# Altium project Power_Supply_5V.PrjPcb
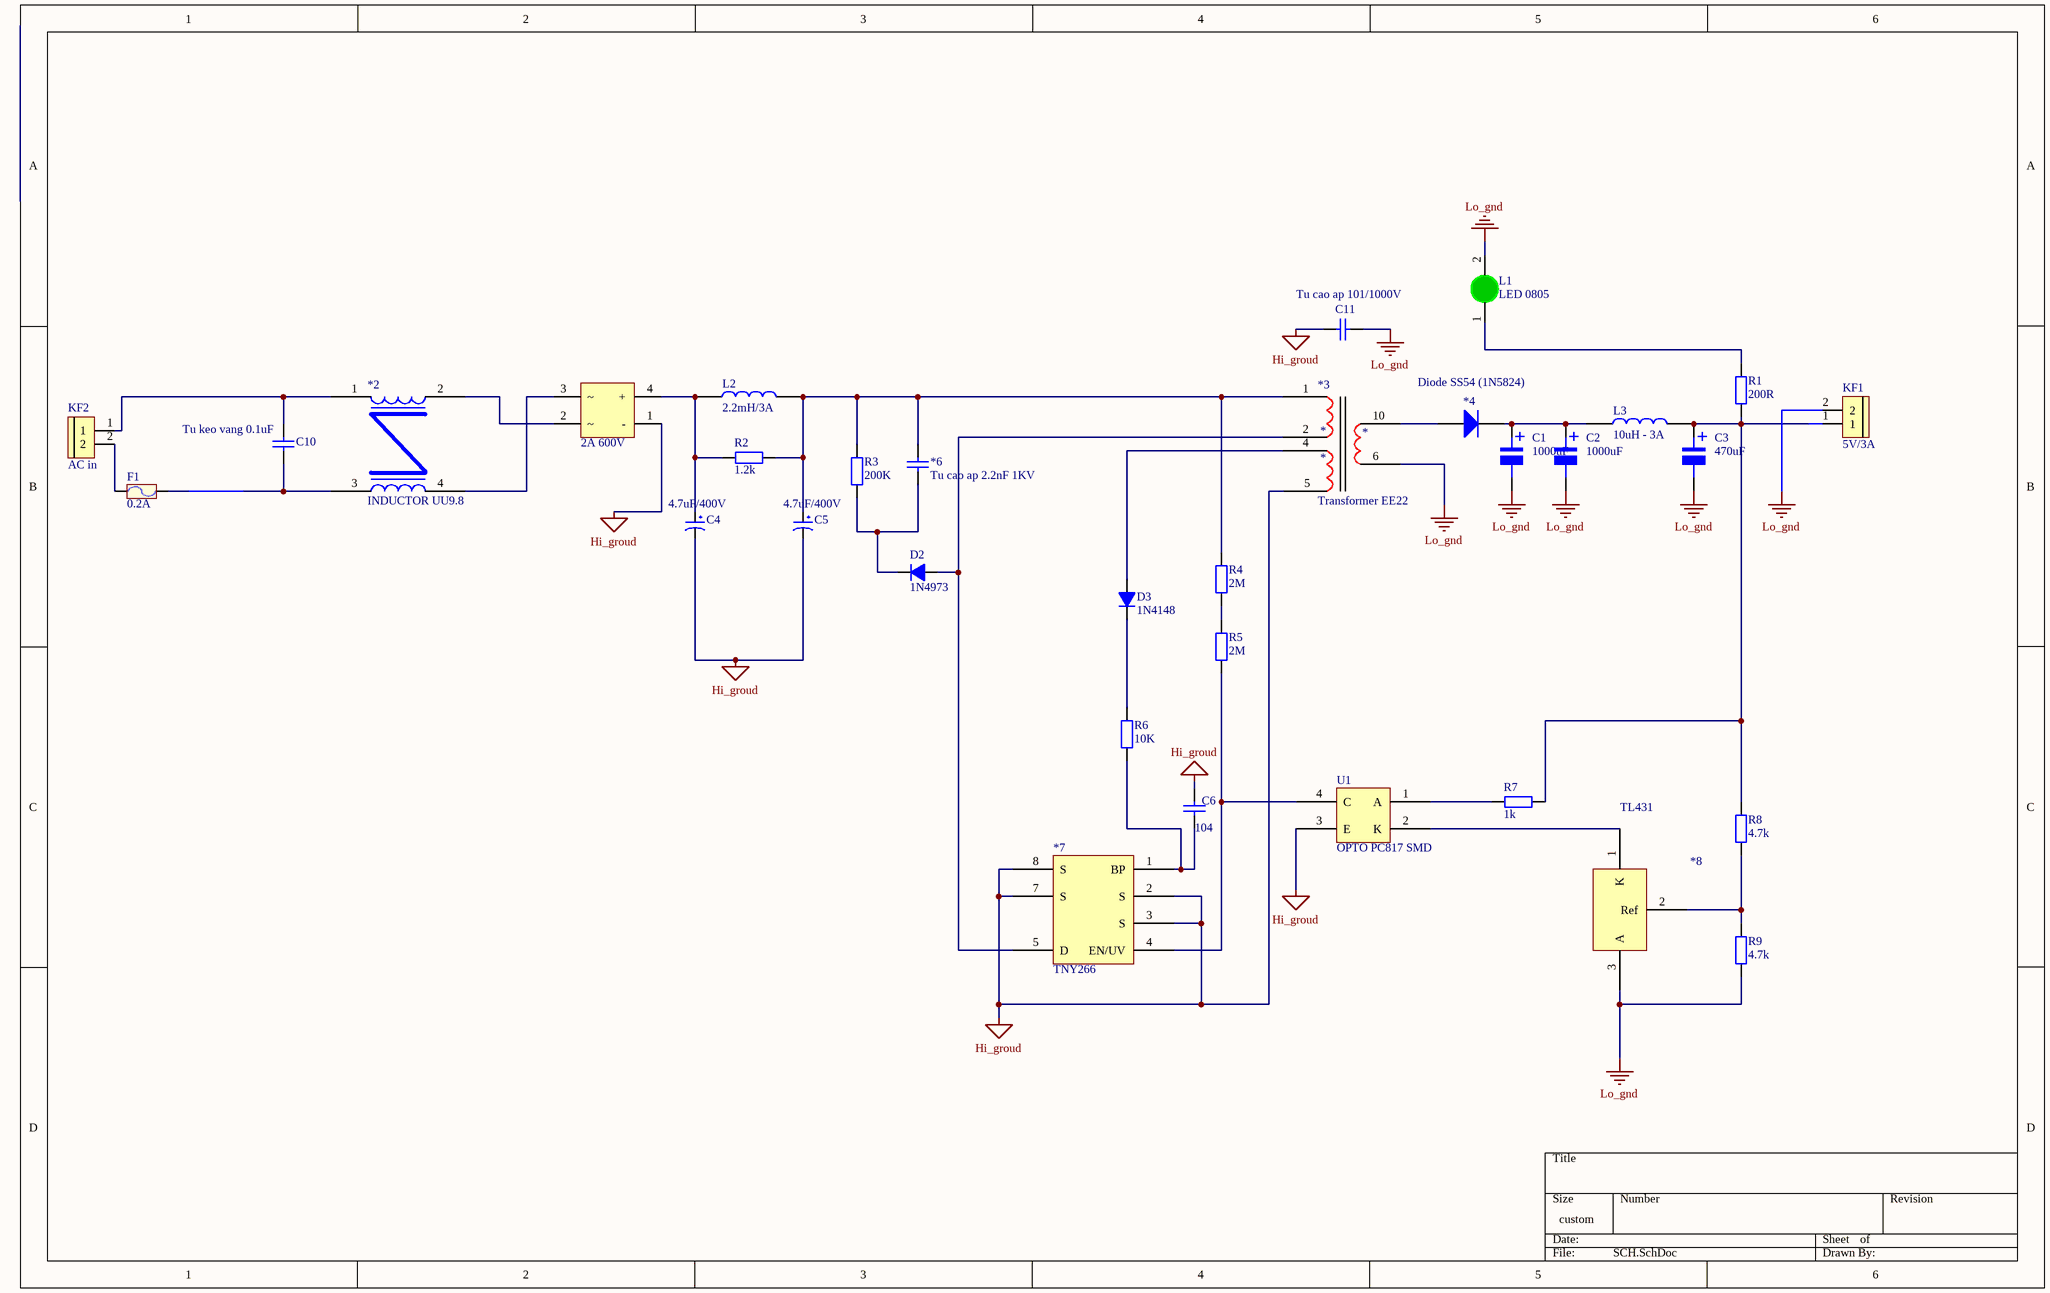
[diagram p0: SCH.SchDoc]
1 sheet, 33 parts. Net scope: global (net labels, ports and power ports of the same name join across sheets).
Board file: PCB.PcbDoc

## Sheet SCH.SchDoc
size 381 x 241 mm; SheetNumber: 1; SheetTotal: 1

### Parts
*2  INDUCTOR UU9.8  [INDUCTOR UU9.8]
*3  Transformer EE22  [TRANSFORMER EE22]
*4  Diode SS54 (1N5824)  [DIODE SMA]
*6  Tu cao ap 2.2nF 1KV  [Tu cao ap]
*7  TNY266  [DIP8]
*8  TL431  [TL431 SOT-23-3]
C1  1000uF  [tu nhom 10 (G)]
C2  1000uF  [tu nhom 10 (G)]
C3  470uF  [tu nhom 8 (f)]
C4  4.7uF/400V  [tu hoa 8mm]
C5  4.7uF/400V  [tu hoa 8mm]
C6  104  [tu 1206]
C10  Tu keo vang 0.1uF  [Tu keo vang 0.1uF]
C11  Tu cao ap 101/1000V  [Tu cao ap]
D1  2A 600V  [DIODE CAU 2A 3A CAM]
D2  1N4973  [DIODE 1A]
D3  1N4148  [DIODE 0.5A]
F1  0.2A  [De Cau Chi 520 630]
KF1  5V/3A  [Con 2 KF301 5.08]
KF2  AC in  [Con 2 KF301 5.08]
L1  LED 0805  [LED-1206-Green]
L2  2.2mH/3A  [CUON CAM 100uH3A]
L3  10uH - 3A  [CUON CAM 100uH3A]
R1  200R  [tro smd 1206]
R2  1.2k  [tro smd 1206]
R3  200K  [Dien tro]
R4  2M  [Dien tro]
R5  2M  [Dien tro]
R6  10K  [Dien tro]
R7  1k  [tro smd 1206]
R8  4.7k  [tro smd 1206]
R9  4.7k  [tro smd 1206]
U1  OPTO PC817 SMD  [SOP4]

### Nets
Hi_groud: *3.5 *7.2(S) *7.3(S) *7.7(S) *7.8(S) C4.2 C5.2 C6.1 C11.2 D1.1(-) U1.3(E)
Lo_gnd: *3.6 *8.3(A) C1.2 C2.2 C3.2 C11.1 KF1.2 L1.2(K) R9.1
Net*2_1: *2.1 C10.1 KF2.1
Net*2_2: *2.2 D1.2
Net*2_3: *2.3 C10.2 F1.1
Net*2_4: *2.4 D1.3
Net*3_1: *3.1 *6.1 C5.1 L2.2 R2.2 R3.2 R4.2
Net*3_2: *3.2 *7.5(D) D2.1(A)
Net*3_4: *3.4 D3.1(A)
Net*3_10: *3.10 *4.1(A)
Net*4_2: *4.2(K) C1.1 C2.1 L3.1
Net*6_2: *6.2 D2.2(K) R3.1
Net*7_1: *7.1(BP) C6.2 R6.1
Net*7_4: *7.4(EN/UV) R5.1 U1.4(C)
Net*8_1: *8.1(K) U1.2(K)
Net*8_2: *8.2(Ref) R8.1 R9.2
NetC3_1: C3.1 KF1.1 L3.2 R1.2 R7.2 R8.2
NetC4_1: C4.1 D1.4(+) L2.1 R2.1
NetD3_2: D3.2(K) R6.2
NetF1_2: F1.2 KF2.2
NetL1_1: L1.1(A) R1.1
NetR4_1: R4.1 R5.2
NetR7_1: R7.1 U1.1(A)

### Notes on the sheet
- (in symbol Tu Nhom 470uF 16V) +
- (in symbol Tu Nhom 1000uF 10V) +

### Library data of the parts
*7 = TNY264
C1 C2 = Tu Nhom 1000uF 10V: Dán; So_Chan: 2; Don_Vi: Con; Ten_Linh_Kien: Tụ Nhôm 1000uF 10V; Ma_Hang: MH007515; Chung_Loai: Dán; Kieu_Chan: *
C3 = Tu Nhom 470uF 16V: Dán; Don_Vi: Con; So_Chan: 2; Ten_Linh_Kien: Tụ Nhôm 470uF 16V 8x10.4MM; Ma_Hang: MH001940; Chung_Loai: Dán; Kieu_Chan: *
C4 C5 = Tu Hoa 4.7uF 400V 8x12: Cắm; Don_Vi: Con; So_Chan: 2; Ten_Linh_Kien: Tụ Hóa 4.7uF 400V 8x12MM; Ma_Hang: MH003744; Chung_Loai: Cắm; Kieu_Chan: *
C6 = Tu 1206 104 50V 20%: Dán; Don_Vi: Con; So_Chan: 2; Ten_Linh_Kien: Tụ 1206 104-0.1uF 20% 50V; Ma_Hang: MH004544; Chung_Loai: Dán; Kieu_Chan: *
C11 = Tu cao ap 1000V
D1 = Diode CAU 2A VUONG: Cắm; Ten_Linh_Kien: Diode Cầu 2A 600V KBP206 Vuông; Don_Vi: Con; Ma_Hang: MH001206; Ghi_Chu: *; Kieu_Chan: *; Chung_Loai: Cắm
D2 = Diode 1N4007: Cắm; Ten_Linh_Kien: Diode 1N4007 1A (DIP); Don_Vi: Con; Ma_Hang: MH001063; Ghi Chu: *; Kieu_Chan: *; Chung_Loai: Cắm
D3 = Diode 1N4148: Cắm; Ten_Linh_Kien: Diode 1N4148 DO35 450mA 100V ( 1N4148 DIP); Don_Vi: Con; Ma_Hang: MH001065; Ghi Chu: *; Kieu_Chan: *; Chung_Loai: Cắm
F1 = De Cau Chi 520 630: 5x20mm; Ma_Hang: MH001473; Ten: Đế Cầu Chì 5x20MM 6x30MM SMD01
KF1 KF2 = CON 2 KF301: Cắm; Ma_Hang: MH000987; Ten_Linh_Kien: CON 2 KF301-2P 5.08MM Xanh Dương; Don_Vi: Con; Chung_Loai: Cắm; Ghi_Chu: *; Kieu_Chan: *
L1 = LED 1206 Xanh La: Dán; Don_Vi: Con; Ma_Hang: MH002947; Ten_Linh_Kien: LED1206 Màu Xanh Lá (Green); Ghi_Chu: *; Kieu_Chan: *; Chung_Loai: Dán
L2 L3 = CUON CAM 470uH DIP: Cắm; Don_Vi: Con; Ma_Hang: MH002232; Ten_Linh_Kien: Cuộn Cảm 470uH 3A 8x10MM; Ghi_Chu: *; Kieu_Chan: *; Chung_Loai: Cắm
R1 = Tro 1206 1% 200R: Dán; So_Chan: 2; Don_Vi: Con; Ten_Linh_Kien: Trở 1206 1% 200R; Ma_Hang: MH005895; Chung_Loai: Dán; Kieu_Chan: *
R2 R7 = Tro 1206 1% 1k: Dán; Don_Vi: Con; So_Chan: 2; Ten_Linh_Kien: Trở 1206 1% 1k; Ma_Hang: MH005880; Chung_Loai: Dán; Kieu_Chan: *
R3-R6 = Resistor: Cắm
R8 R9 = Tro 1206 5% 4.7K: Dán; So_Chan: 2; Don_Vi: Con; Ten_Linh_Kien: Trở 1206 5% 4.7k; Ma_Hang: MH005908; Chung_Loai: Dán; Kieu_Chan: *
U1 = OPTO PC817 SMD: Single Opto; Value: PC817